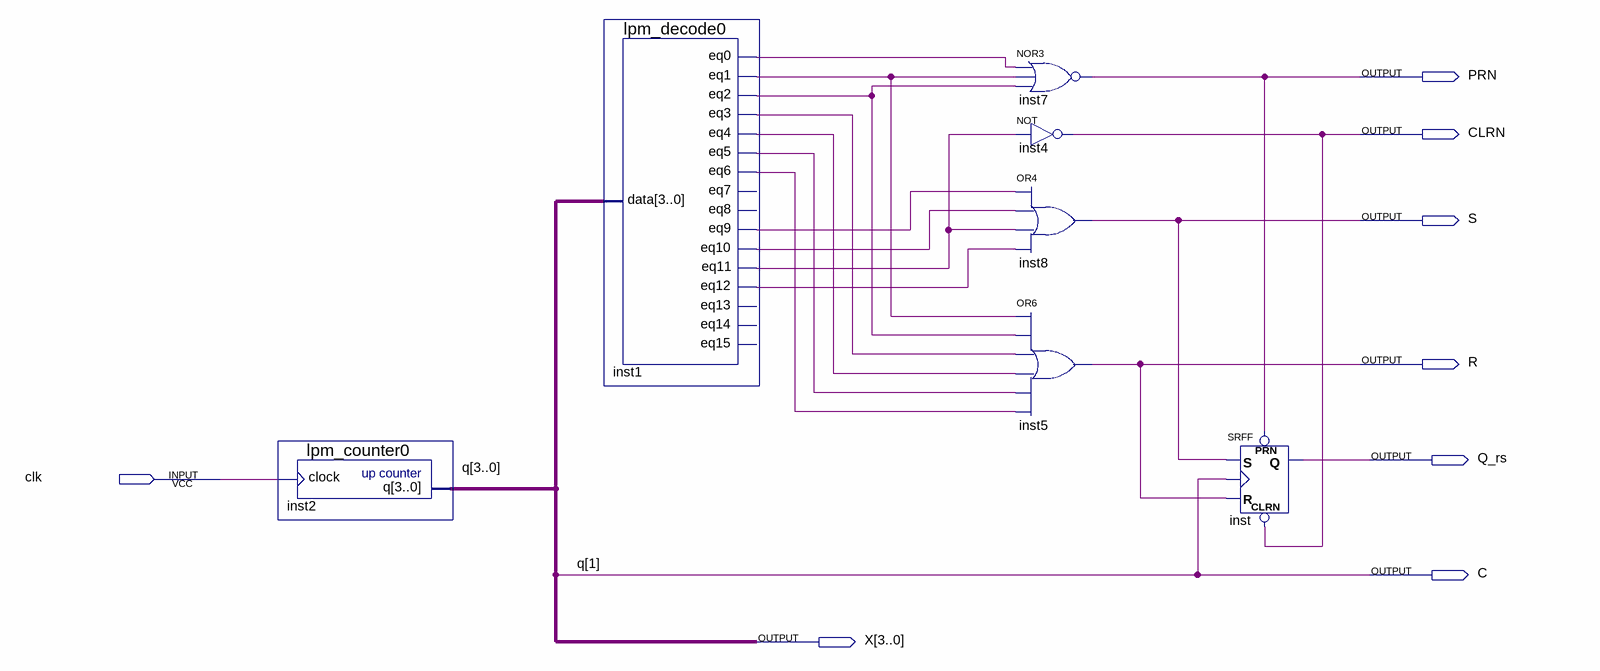
[diagram p0: schematic sheet]
// Quartus schematic rs_trig.bdf as structural Verilog: 7 symbols, 8 pins
module rs_trig (
  input  clk,
  output PRN,
  output CLRN,
  output S,
  output R,
  output Q_rs,
  output C,
  output [3:0] X
);

  wire inst1_eq0, inst1_eq1, inst1_eq2, inst1_eq3, inst1_eq4, inst1_eq5, inst1_eq6, inst1_eq9, inst1_eq10,
       inst1_eq11, inst1_eq12;

  lpm_counter0 inst2 (.clock(clk), .q({X[3:2], C, X[0]}));
  lpm_decode0 inst1 (
    .data({X[3:2], C, X[0]}), .eq0(inst1_eq0), .eq1(inst1_eq1), .eq2(inst1_eq2), .eq3(inst1_eq3),
    .eq4(inst1_eq4), .eq5(inst1_eq5), .eq6(inst1_eq6), .eq9(inst1_eq9), .eq10(inst1_eq10), .eq11(inst1_eq11),
    .eq12(inst1_eq12));  // open: eq7, eq8, eq13, eq14, eq15
  nor inst7 (PRN, inst1_eq0, inst1_eq1, inst1_eq2);
  not inst4 (CLRN, inst1_eq11);
  or inst8 (S, inst1_eq9, inst1_eq10, inst1_eq11, inst1_eq12);
  or inst5 (R, inst1_eq1, inst1_eq2, inst1_eq3, inst1_eq4, inst1_eq5, inst1_eq6);
  SRFF inst (.PRN(PRN), .CLRN(CLRN), .S(S), .R(R), .CLK(C), .Q(Q_rs));

  assign X[1] = C;

  // Other names for the same wires on the sheet: q[3:0] = {X[3:2], C, X[0]}
endmodule
